# EAGLE design DemoBB_1289 (EAGLE 6.4)
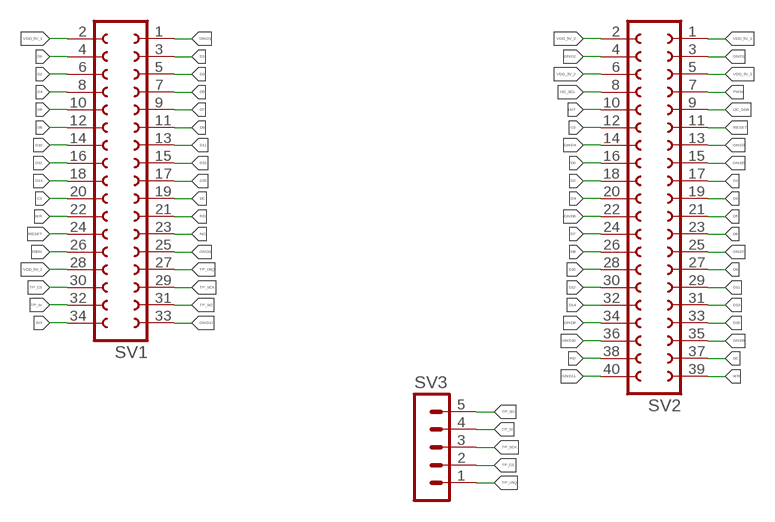
[diagram p0: schematic, sheet 1]

## Parts
SV1  FE17-2  [FE17-2]
SV2  FE20-2  [FE20-2]
SV3  MA05-1  [MA05-1]

## Nets
3V3: SV1.34
CS: SV1.20 SV2.12
D0: SV1.4 SV2.16
D1: SV1.3 SV2.17
D2: SV1.6 SV2.18
D3: SV1.5 SV2.19
D4: SV1.8 SV2.20
D5: SV1.7 SV2.21
D6: SV1.10 SV2.23
D7: SV1.9 SV2.24
D8: SV1.12 SV2.26
D9: SV1.11 SV2.27
D10: SV1.14 SV2.28
D11: SV1.13 SV2.29
D12: SV1.16 SV2.30
D13: SV1.15 SV2.31
D14: SV1.18 SV2.32
D15: SV1.17 SV2.33
DC: SV1.19 SV2.37
GND1: SV1.1 SV2.3
GND2: SV1.25 SV2.4
GND3: SV2.13
GND4: SV2.14
GND5: SV2.15
GND6: SV2.22
GND7: SV2.25
GND8: SV2.34
GND9: SV2.35
GND10: SV2.36
GND11: SV1.33 SV2.40
I2C_SCL: SV2.8
I2C_SDA: SV2.9
INT: SV2.10
N$62: SV1.26
NC: SV1.23
PWM: SV2.7
RD: SV1.21 SV2.38
RESET: SV1.24 SV2.11
TP_CS: SV1.30 SV3.2
TP_IRQ: SV1.27 SV3.1
TP_SCK: SV1.29 SV3.3
TP_SI: SV1.32 SV3.4
TP_SO: SV1.31 SV3.5
VDD_3V_1: SV2.5
VDD_3V_2: SV2.6
VDD_5V_1: SV1.2 SV2.1
VDD_5V_2: SV1.28 SV2.2
WR: SV1.22 SV2.39

## Library data of the parts
SV1 = con-lsta:FE17-2: FEMALE HEADER; OC_FARNELL: unknown; OC_NEWARK: unknown
SV2 = con-lsta:FE20-2: FEMALE HEADER; OC_FARNELL: unknown; OC_NEWARK: unknown
SV3 = con-lstb:MA05-1: PIN HEADER; OC_FARNELL: unknown; OC_NEWARK: unknown

## Board
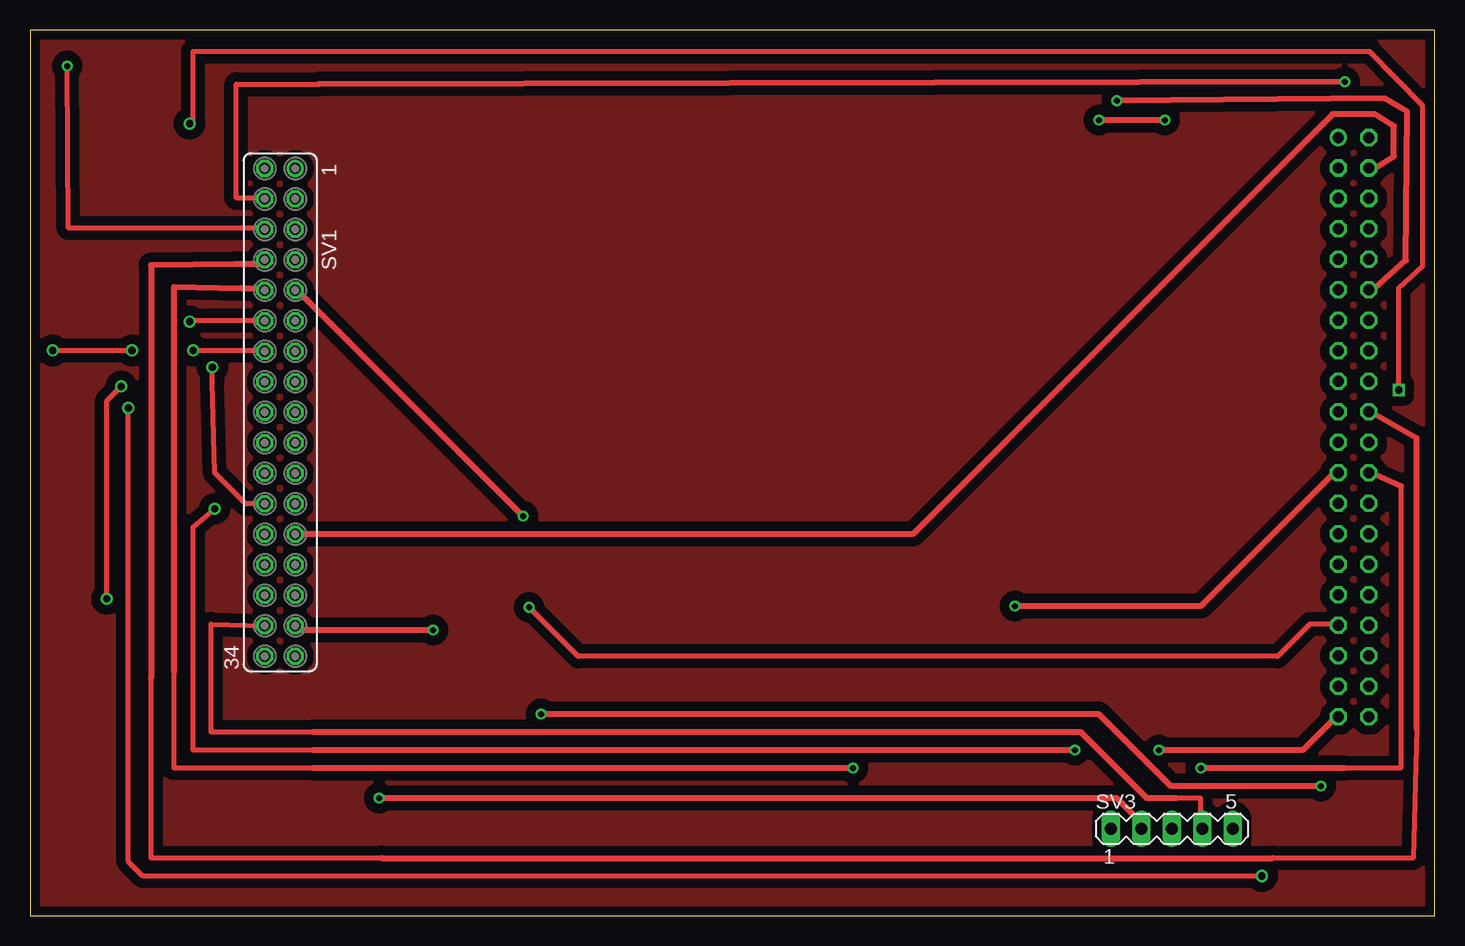
[diagram p1: board, top side]
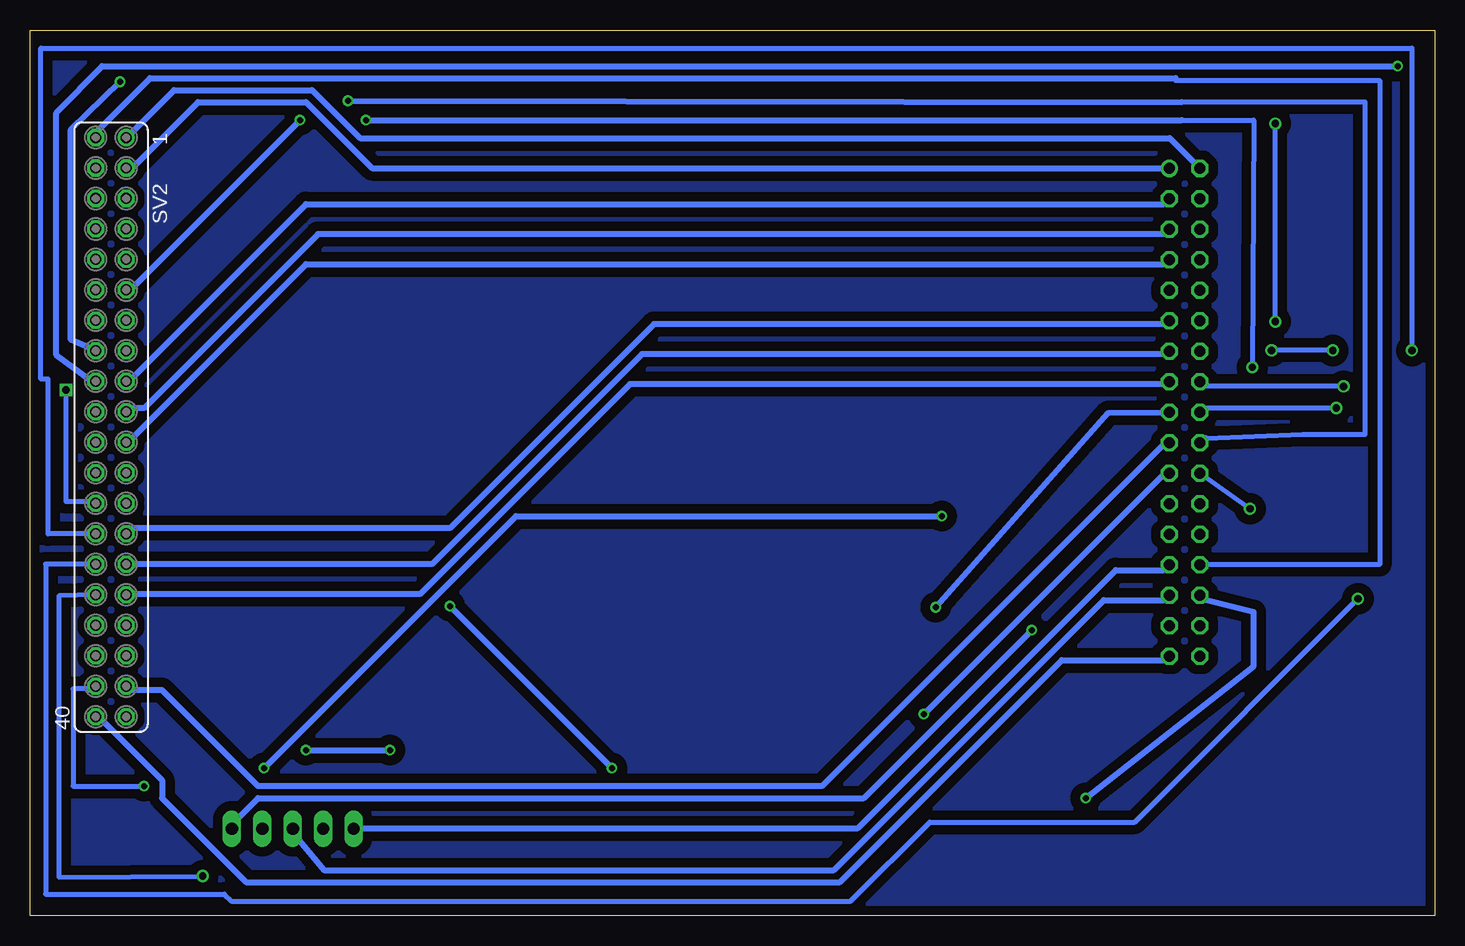
[diagram p2: board, bottom side, seen from below]

Size 117.1 x 73.8 mm. Coordinates in mm from the lower left corner, seen from the top.
Outline: 0,0 117.1,0 117.1,73.8 0,73.8 0,0
Copper layers (1*16): Top 0.035mm / dielectric 1.5mm / Bottom 0.035mm
Design rules "default *": minimum track width 0.4mm, minimum drill 0.5mm, track to track 0.8mm, track to pad 0.8mm, pad to pad 0.5mm, via to via 0.5mm, smd to smd 0.5mm, copper to edge 0.8mm, drill to drill 0.8mm, minimum pad ring 10mil, minimum via ring 8mil, stop-mask expansion 4mil, vias tented up to drill 0mil, thermal gap 10mil

### Footprints (pad centres in the part's own frame; a part is rotated, then mirrored left to right if it is on the bottom)
FE17-2 = drill 0.914: 1 -20.32,1.27 | drill 0.914 octagon: 2 -20.32,-1.27; 3 -17.78,1.27; 4 -17.78,-1.27; 5 -15.24,1.27; 6 -15.24,-1.27; 7 -12.7,1.27; 8 -12.7,-1.27; 9 -10.16,1.27; 10 -10.16,-1.27; 11 -7.62,1.27; 12 -7.62,-1.27; 13 -5.08,1.27; 14 -5.08,-1.27; 15 -2.54,1.27; 16 -2.54,-1.27; 17 0,1.27; 18 0,-1.27; 19 2.54,1.27; 20 2.54,-1.27; 21 5.08,1.27; 22 5.08,-1.27; 23 7.62,1.27; 24 7.62,-1.27; 25 10.16,1.27; 26 10.16,-1.27; 27 12.7,1.27; 28 12.7,-1.27; 29 15.24,1.27; 30 15.24,-1.27; 31 17.78,1.27; 32 17.78,-1.27; 33 20.32,1.27; 34 20.32,-1.27
FE20-2 = drill 0.914: 1 -24.13,1.27 | drill 0.914 octagon: 2 -24.13,-1.27; 3 -21.59,1.27; 4 -21.59,-1.27; 5 -19.05,1.27; 6 -19.05,-1.27; 7 -16.51,1.27; 8 -16.51,-1.27; 9 -13.97,1.27; 10 -13.97,-1.27; 11 -11.43,1.27; 12 -11.43,-1.27; 13 -8.89,1.27; 14 -8.89,-1.27; 15 -6.35,1.27; 16 -6.35,-1.27; 17 -3.81,1.27; 18 -3.81,-1.27; 19 -1.27,1.27; 20 -1.27,-1.27; 21 1.27,1.27; 22 1.27,-1.27; 23 3.81,1.27; 24 3.81,-1.27; 25 6.35,1.27; 26 6.35,-1.27; 27 8.89,1.27; 28 8.89,-1.27; 29 11.43,1.27; 30 11.43,-1.27; 31 13.97,1.27; 32 13.97,-1.27; 33 16.51,1.27; 34 16.51,-1.27; 35 19.05,1.27; 36 19.05,-1.27; 37 21.59,1.27; 38 21.59,-1.27; 39 24.13,1.27; 40 24.13,-1.27
MA05-1 = drill 1.016 long: 1 -5.08,0; 2 -2.54,0; 3 0,0; 4 2.54,0; 5 5.08,0

### Placement (x,y rotation side)
SV1  20.85,41.94 270 top
SV2  110.35,40.71 270 bottom
SV3  95.19,7.23 0 top

### Tracks (layer width: path | path; a pad name or v marks a point on that pad's centre or on a via)
CS  (via drill 0.5)
  Top 0.5: v90.6,67.9 112.9,68.1 114.8,67 114.7,54.6 112.1,52.3 SV2.12
  Bottom 0.406: 19.1,39.8 11,40.1 5.8,40.1 5.8,67.8 21.1,67.8
  Bottom 0.5: v90.6,67.9 21.1,67.8 | 19.1,39.8 SV1.20
D0  (via drill 0.5)
  Top 0.406: 19.1,59.8 17.2,59.8 17.2,69.3 24.1,69.3
  Top 0.5: v109.6,69.5 24.1,69.3 | 19.1,59.8 SV1.4
  Bottom 0.5: v109.6,69.5 113.7,65.5 113.7,48 112.1,47.3 SV2.16
D1
  Bottom 0.5: SV1.3 22.6,59.3 94.1,59.3 108.6,44.8 SV2.17
D2  (via drill 0.5)
  Top 0.406: 19.1,57.3 3.2,57.3 v3.1,70.8
  Top 0.5: 19.1,57.3 SV1.6
  Bottom 0.5: v3.1,70.8 111.1,70.8 114.9,66.9 114.9,46.7 112.1,44.6 SV2.18
D3
  Bottom 0.5: SV2.19 108.6,42.3 107.6,42.3 93.1,56.8 22.6,56.8 SV1.5
D4
  Top 0.406: 115.6,15.6 115.3,4.8 103.6,4.8 | 29.3,4.8 10.1,4.8 10.1,19.8
  Top 0.5: 115.6,15.6 115.6,39.8 112.1,41.8 SV2.20 | 29.3,4.8 103.6,4.8 | 10.1,19.8 10.1,54.2 17.1,54.3 19.1,54.3 SV1.8
D5
  Bottom 0.5: SV1.7 22.6,54.3 94.1,54.3 108.6,39.8 SV2.21
D6  (via drill 0.5)
  Top 0.406: 23.6,12.3 12,12.3 12,20.3
  Top 0.5: 12,20.3 12,52.4 17.6,52.3 19.1,52.3 SV1.10 | v68.6,12.3 23.6,12.3 | v82.1,25.8 97.6,25.8 108.6,36.8 SV2.23
  Bottom 0.5: v82.1,25.8 v68.6,12.3
D7  (via drill 0.5)
  Top 0.406: 109.6,12.3 114.3,12.3 114.3,35.8
  Top 0.5: v41.1,33.3 22.6,51.8 SV1.9 | 109.6,12.3 v97.6,12.3 | 114.3,35.8 112.1,36.8 SV2.24
  Bottom 0.5: v41.1,33.3 76.6,33.3 v97.6,12.3
D8  (via drill 0.6)
  Top 0.406: v114.1,43.8 114.1,52.3 116.1,54.1 116.1,67.5 111.7,72 13.6,72 13.6,66 v13.3,66 | SV1.12 13.36,49.56 v13.3,49.5
  Bottom 0.406: SV2.26 111.62,34.5 114.1,34.5 v114.1,43.8 | v13.3,49.5 v13.3,66
D9
  Bottom 0.5: SV2.27 108.6,32.3 82.1,32.3 65.1,49.3 22.6,49.3 SV1.11
D10  (via drill 0.6)
  Top 0.406: v1.9,47.1 v8.5,47.1 | v13.6,47.1 19.58,47.1 SV1.14
  Bottom 0.406: SV2.28 115.6,31.82 115.6,44.7 116.2,44.7 116.2,72.3 1.9,72.3 v1.9,47.1 | v8.5,47.1 v13.6,47.1
D11
  Bottom 0.5: SV2.29 108.6,29.3 83.6,29.3 66.1,46.8 22.6,46.8 SV1.13
D12  (via drill 0.6)
  Top 0.406: v6.4,26.4 6.4,42.9 v7.6,44.1
  Bottom 0.406: SV2.30 115.8,29.28 115.8,1.8 100.9,1.8 100.3,1.2 48.7,1.2 42.1,7.8 25,7.8 v6.4,26.4 | v7.6,44.1 19.58,44.1 SV1.16
D13
  Bottom 0.5: SV2.31 108.6,26.8 84.6,26.8 67.1,44.3 22.6,44.3 SV1.15
D14  (via drill 0.6)
  Top 0.406: v102.7,3.3 9.4,3.3 8.2,4.5 v8.2,42.3
  Bottom 0.406: SV2.32 114.7,26.64 114.7,3.2 v102.7,3.3 | v8.2,42.3 19.58,42.3 SV1.18
D15  (via drill 0.5)
  Top 0.406: 108.6,24.3 106.7,24.3 104,21.6 45.7,21.6 v41.6,25.7
  Top 0.5: 108.6,24.3 SV2.33
  Bottom 0.5: v41.6,25.7 27.2,41.9 SV1.17
DC
  Bottom 0.5: SV2.37 108.6,18.8 106.1,18.8 98.1,10.8 51.1,10.8 22.6,39.3 SV1.19
GND1
  Bottom 0.5: SV1.1 22.6,62.3 88.6,62.3 94.1,67.8 103.1,67.8 108.6,62.3 SV2.3
GND2
  Top 0.5: SV1.25 22.6,31.8 73.6,31.8 108.6,66.8 112.1,66.8 113.7,65.8 113.7,63.3 112.1,62.3 SV2.4
GND11
  Bottom 0.5: SV1.33 22.6,21.3 31.1,21.3 49.6,2.8 99.1,2.8 106.1,9.8 106.1,11.3 111.6,16.8 SV2.40
N$1
  pour Bottom: 0,73.8 117.1,73.8 117.1,0 0,0
N$2
  pour Top: 0,73.8 117.1,73.8 117.1,0 0,0
RD  (via drill 0.5)
  Top 0.5: v42.6,16.8 89.1,16.8 95.1,10.8 v107.6,10.8
  Bottom 0.406: 112.1,18.8 112.1,18.9 113.5,18.9 113.5,10.8 v107.6,10.8
  Bottom 0.5: v42.6,16.8 22.6,36.8 SV1.21 | 112.1,18.8 SV2.38
RESET  (via drill 0.5, 0.6)
  Top 0.406: SV1.24 17.98,34.32 15.4,36.9 15.2,44.5 v15.2,45.7
  Top 0.5: v94.6,66.3 v89.1,66.3
  Bottom 0.406: 21.1,66.3 15.1,66.3 v15.2,45.7
  Bottom 0.5: v89.1,66.3 21.1,66.3 | v94.6,66.3 108.6,52.3 SV2.11
TP_CS  (via drill 0.5)
  Top 0.5: v29.1,9.8 90.6,9.8 93.1,7.3 SV3.2
  Bottom 0.5: v29.1,9.8 15.1,20.8 15.1,25.3 19.1,26.3 SV1.30
TP_IRQ
  Bottom 0.5: SV1.27 22.6,28.8 26.6,28.8 48.1,7.3 90.1,7.3 SV3.1
TP_SCK
  Bottom 0.5: SV1.29 22.6,26.3 27.6,26.3 50.1,3.8 92.6,3.8 95.1,6.8 SV3.3
TP_SI
  Top 0.406: 23.6,15.3 15.1,15.3 15.1,24.3 SV1.32 | 97.6,7.3 97.6,9.8 95.6,9.8
  Top 0.5: 23.6,15.3 87.6,15.3 93.1,9.8 95.6,9.8 | 97.6,7.3 SV3.4
TP_SO  (via drill 0.5)
  Top 0.5: v33.6,23.8 22.6,23.8 SV1.31
  Bottom 0.5: v33.6,23.8 47.6,9.8 98.1,9.8 100.6,7.3 SV3.5
VDD_5V_1
  Bottom 0.5: SV1.2 19.6,62.3 22.1,64.8 89.6,64.8 93.6,68.8 105.1,68.8 108.6,65.3 SV2.1
VDD_5V_2
  Bottom 0.406: SV1.28 4.6,29.24 4.6,69.6 21.6,69.6 21.6,69.8
  Bottom 0.5: 21.6,69.8 107.1,69.8 111.6,65.3 SV2.2 | 19.1,29.3 SV1.28
WR  (via drill 0.5, 0.6)
  Top 0.406: 23.6,13.8 13.6,13.8 13.6,32.4 v15.4,33.9
  Top 0.5: v87.1,13.8 23.6,13.8 | v94.1,13.8 106.1,13.8 108.6,16.3 SV2.39
  Bottom 0.406: v15.4,33.9 SV1.22
  Bottom 0.5: v94.1,13.8 v87.1,13.8